# Altium schematic sheet Sheet3_Bat.SchDoc
size A4
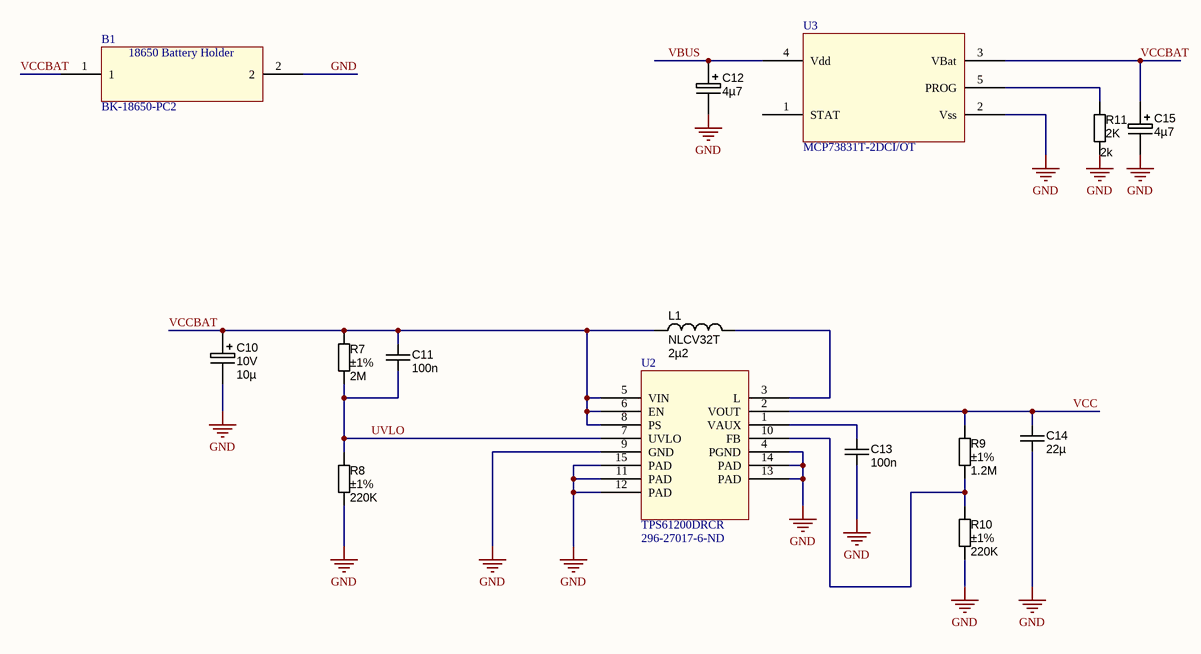
[diagram p0: Sheet3_Bat.SchDoc]

## Parts
B1  BK-18650-PC2  [BK-18650-PC2]
C10  Ratings: 10V  [CAPMP2012X150USR]  (hidden comment: 10µ)
C11  value 100n  [CAPC2012X135N]  (hidden comment: approved sub OK)
C12  4µ7  [CAPMP3216X180N]
C13  value 100n  [CAPC2012X135N]  (hidden comment: approved sub OK)
C14  value 22µ  [CAPC3225X220N]  (hidden comment: approved sub OK)
C15  4µ7  [CAPMP3216X180N]
L1  NLCV32T  value 2µ2  [INDM3225X240N]
R7  value 2M  Tolerance: ±1%  [RESC2012X70N]  (hidden comment: Thick Film)
R8  value 220K  Tolerance: ±1%  [RESC2012X70N]  (hidden comment: Thick Film)
R9  value 1.2M  Tolerance: ±1%  [RESC2012X70N]  (hidden comment: Thick Film)
R10  value 220K  Tolerance: ±1%  [RESC2012X70N]  (hidden comment: Thick Film)
R11  2k  [RESC1005X40N]
U2  TPS61200DRCR  Supplier Part Number 1: 296-27017-6-ND  [QFN-10_PAD]
U3  MCP73831T-2DCI/OT  [SOT95P270X145-5N]

## Nets
GND: B1.2 C10.2 C12.2 C13.2 C14.2 C15.2 R8.2 R10.2 R11.1 U2.4(PGND) U2.9(GND) U2.11(PAD) U2.12(PAD) U2.13(PAD) U2.14(PAD) U2.15(PAD) U3.2(Vss)
UVLO: C11.2 R7.2 R8.1 U2.7(UVLO)
VBUS: C12.1 U3.4(Vdd)
VCC: C14.1 R9.1 U2.2(VOUT)
VCCBAT: B1.1 C10.1 C11.1 C15.1 L1.1 R7.1 U2.5(VIN) U2.6(EN) U2.8(PS) U3.3(VBat)
NetC13_1: C13.1 U2.1(VAUX)
NetL1_2: L1.2 U2.3(L)
NetR9_2: R9.2 R10.1 U2.10(FB)
NetR11_2: R11.2 U3.5(PROG)

Not connected (* = marked no-connect by the designer): U3 1(STAT)

## Notes on the sheet
- (in symbol BK-18650-PC2) 18650 Battery Holder

## Library data of the parts
B1 = BK-18650-PC2: BK-18650-PC2 HOLDER BATT 1/LI-ION PROTECTED
C10 = CAPT_10u_0805_10V: Capacitor SMD Tantalum 10uF 20% 10V 0805; Manufacturer 1: AVX Corporation; Manufacturer Part Number 1: TAJP106M010RNJ; SCDType: spec; Package / Case: 0805 (2012 metric); Tolerance: ±20%; Material: Tantalum; Supplier 1: Digi-Key; Supplier Part Number 1: 478-3281-1-ND; Value: 10µ
C11 C13 = CAPC_100n_0805_X7R_100V_10%: Capacitor SMD Cer 100nF 10% 100V X7R 0805; Manufacturer 1: TDK Corporation; Manufacturer Part Number 1: C2012X7R2A104K; Ratings: 100V; X7R; Material: ceramic; SCDType: undef; Package / Case: 0805; Tolerance: ±10%; Supplier 1: Digi-Key; Supplier Part Number 1: 445-1418-1-ND
C12 C15 = CAPT_4u7_3216_16V: Capacitor SMD Tantalum 4.7uF 10% 16V 3216-18; Manufacturer 1: Vishay/Sprague; Manufacturer Part Number 1: 293D475X9016A2TE3; SCDType: undef; Package / Case: EIA 535BAAC size A; Ratings: 16V; Tolerance: ±10%; Material: Tantalum; Supplier 1: Digi-Key; Supplier Part Number 1: 718-1148-1-ND; Value: 4µ7
C14 = CAPC_22u_1210_16V: Capacitor SMD Cer 22uF 20% 16V X7R 1210; Manufacturer: TDK Corporation; Manufacturer Part Number: C3225X7R1C226K; Ratings: 16V; X7R; SCDType: spec; Tolerance: ±20%; Package / Case: 1210 (3225 metric); Supplier 1: Digi-Key; Supplier Part Number 1: 445-3945-2-ND
L1 = INDC_2u2_1210_1200mA: Inductor 2.2uH 1.2A 1210 SMD chip; Manufacturer 1: TDK Corporation; Manufacturer Part Number 1: NLCV32T-2R2M-PFR; Ratings: 1.2 Adc; Tolerance: ±20%; Type: Ferrite Core; DC Resistance (DCR): 115 mOhm; Q @ Freq: 15 @ 7.96MHz; Frequency - Self Resonant: 68MHz; Frequency - Test: 7.96MHz; SCDType: source; Package / Case: 1210 (3225 Metric); Supplier 1: Digi-Key; Supplier Part Number 1: 445-3650-1-ND; ComponentLink1URL: http://www.tdk.co.jp/tefe02/e511_nlcv_nlc.pdf; ComponentLink1Description: http://www.tdk.co.jp/tefe02/e511_nlcv_nlc.pdf; Operating Temperature: -40°C ~ 125°C
R7 = RES_2M_0805_1%: Resistor SMD chip 2M Ohm 0.125W 1% 0805; Ratings: 1/8W; SCDType: spec; Package / Case: 0805 (2012 metric); Supplier 1: Digi-Key; Supplier Part Number 1: 311-2.00MCRCT-ND
R8 R10 = RES_220K_0805_1%: Resistor SMD chip 220k Ohm 0.125W 1% 0805; Ratings: 1/8W; SCDType: spec; Package / Case: 0805 (2012 metric); Supplier 1: Digi-Key; Supplier Part Number 1: 311-220KCRCT-ND
R9 = RES_1p2m_0805_1%: Resistor SMD chip 1.2M Ohm 0.125W 1% 0805; Ratings: 1/8W; SCDType: spec; Package / Case: 0805 (2012 metric); Supplier 1: Digi-Key; Supplier Part Number 1: 311-1.20MCRDKR-ND
R11 = RES_2K_0402_1%: Resistor SMD chip 2k Ohm 0.063W 1% 0402; Ratings: 1/16 W; Tolerance: ±5%; SCDType: spec; Package / Case: 0402 (1005 metric); Material: Thick Film; ComponentLink1URL: http://www.vishay.com/doc?20035; ComponentLink1Description: http://www.vishay.com/doc?20035; ComponentLink2URL: http://www.yageo.com/documents/recent/PYu-RC0402_51_RoHS_L_6.pdf; ComponentLink2Description: http://www.yageo.com/documents/recent/PYu-RC0402_51_RoHS_L_6.pdf; Supplier 1: Digi-Key; Supplier 2: Allied; Value: 2K; Supplier Part Number 1: 541-2.00KLTR-ND; Supplier Part Number 2: 70265465
U2 = TPS61200DRCR: TPS61200DRCR Boost Switching Regulator IC Positive Adjustable 1.8V 1 Output 1.2A (Switch) 10-VFDFN Exposed Pad; Supplier 1: Digi-Key
U3 = MCP73831T-2DCI/OT: IC CONTROLLR LI-ION 4.2V SOT23-5